# EAGLE schematic Udi's Bridge brake (EAGLE 7.2.0)
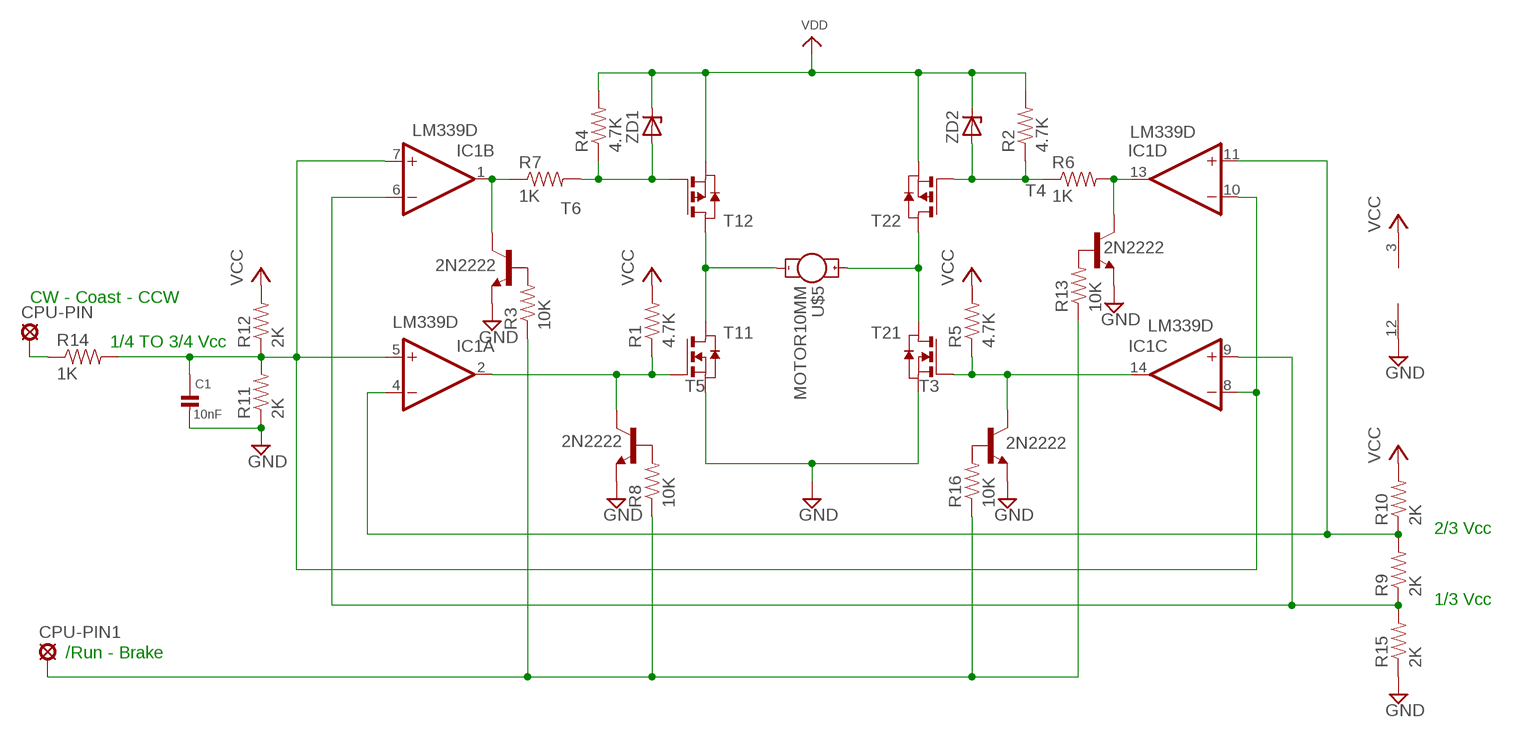
[diagram p0: schematic, sheet 1]

## Parts
C1  10nF  CAP_CERAMIC0805  [0805]
CPU-PIN  CPU I/O pin  LSP13  [LSP13]
CPU-PIN1  CPU I/O pin  LSP13  [LSP13]
IC1  LM339D  [SO14]
R1  4.7K  RESISTOR0805-RES  [0805]
R2  4.7K  RESISTOR0805-RES  [0805]
R3  10K  RESISTOR0805-RES  [0805]
R4  4.7K  RESISTOR0805-RES  [0805]
R5  4.7K  RESISTOR0805-RES  [0805]
R6  1K  RESISTOR0805-RES  [0805]
R7  1K  RESISTOR0805-RES  [0805]
R8  10K  RESISTOR0805-RES  [0805]
R9  2K  RESISTOR0805-RES  [0805]
R10  2K  RESISTOR0805-RES  [0805]
R11  2K  RESISTOR0805-RES  [0805]
R12  2K  RESISTOR0805-RES  [0805]
R13  10K  RESISTOR0805-RES  [0805]
R14  1K  RESISTOR0805-RES  [0805]
R15  2K  RESISTOR0805-RES  [0805]
R16  10K  RESISTOR0805-RES  [0805]
T1  PN_MOSFET-SO8  [SO8]
T2  PN_MOSFET-SO8  [SO8]
T3  2N2222  [TO18]
T4  2N2222  [TO18]
T5  2N2222  [TO18]
T6  2N2222  [TO18]
U$5  MOTOR10MM  [VIBE-MOTOR-10MM]
ZD1  ZENERSOD-123  [SOD-123]
ZD2  ZENERSOD-123  [SOD-123]

## Nets
GND: C1.2 IC1.12(P:GND) R11.1 R15.1 T1.1(1:S) T2.1(1:S) T3.1(E) T4.1(E) T5.1(E) T6.1(E)
N$1: T2.5(2:D) T2.6(2:D) T2.7(1:D) T2.8(1:D) U$5.+
N$2: T1.5(2:D) T1.6(2:D) T1.7(1:D) T1.8(1:D) U$5.-
N$3: IC1.1(B:OUT) R7.1 T6.3(C)
N$4: IC1.13(D:OUT) R6.2 T4.3(C)
N$5: IC1.2(A:OUT) R1.1 T1.2(1:G) T5.3(C)
N$6: IC1.14(C:OUT) R5.1 T2.2(1:G) T3.3(C)
N$7: R2.1 R6.1 T2.4(2:G) ZD2.A
N$8: R4.1 R7.2 T1.4(2:G) ZD1.A
N$9: IC1.4(A:-IN) IC1.11(D:+IN) R9.2 R10.1
N$10: IC1.6(B:-IN) IC1.9(C:+IN) R9.1 R15.2
N$11: CPU-PIN.MP R14.1
N$12: C1.1 IC1.5(A:+IN) IC1.7(B:+IN) IC1.8(C:-IN) IC1.10(D:-IN) R11.2 R12.1 R14.2
N$13: R3.2 T6.2(B)
N$14: R8.2 T5.2(B)
N$15: R13.2 T4.2(B)
N$16: R16.2 T3.2(B)
N$17: CPU-PIN1.MP R3.1 R8.1 R13.1 R16.1
VCC: IC1.3(P:V+) R1.2 R5.2 R10.2 R12.2
VDD: R2.2 R4.2 T1.3(2:S) T2.3(2:S) ZD1.C ZD2.C

## Notes on the sheet
- CW - Coast - CCW
- 1/4 TO 3/4 Vcc
- 2/3 Vcc
- 1/3 Vcc
- /Run - Brake

## Library data of the parts
C1 = microbuilder:CAP_CERAMIC: Ceramic Capacitors 0402 - 0402 Surface Mount Capacitors 16pF 50V 5% [Digikey: 445-4899-2-ND] 18pF 50V 5% [Digikey: 490-1281-2-ND] 22pF 50V 5% [Digikey: 490-1283-2-ND] 68pF 50V 5% [Digikey: 490-1289-2-ND] 0.1uF 10V 10% [Digikey: 490-1318-2-ND] 1.0uF 6.3V 10% [Digikey: 490-1320-2-ND] 0603 - 0603 Surface Mount Capacitors 16 pF 50V 5% [Digikey: 445-5051-2-ND] 22 pF 50V [Digikey: PCC220ACVTR-ND] 33 pF 50V 5% [Digikey: 490-1415-1-ND] 56pF 50V 5% [Digikey: 490-1421-1-ND] 220pF 50V 5% [Digikey: 445-1285-1-ND] 680 pF 50V 2200 pF 50V 5% C0G [Digikey: 445-1297-1-ND] 5600 pF 100V 5% X7R [Digikey: 478-3711-1-ND] 0.1 µF 25V 10% [Digikey: PCC2277TR-ND] 0.22 µF 16V 10% X7R [Digikey: 445-1318-1-ND] 1.0 µF 25V 10% [Digikey: 445-5146-2-ND] 0603 - RF Specific 3pF 250V +/-0.1pF RF [Digikey: 712-1347-1-ND] 18 pF 250V 5% [Digikey: 478-3505-1-ND or 712-1322-1-ND] 56 pF 250V 5% C0G RF [Digikey: 490-4867-1-ND] 68 pF 250V RF [Digikey: 490-4868-1-ND] 0805 - 0805 Surface Mount Capacitors 220 pF 250V 2% RF Ceramic Capacitor [Digikey: 712-1398-1-ND] 1000 pF 50V 2% NP0 Ceramic Capacitor [Digikey: 478-3760-1-ND] 0.1 µF 25V 10% Ceramic Capacitor [Digikey: PCC1828TR-ND] 1.0 µF 16V 10% Ceramic Capacitor[Digikey: 490-1691-2-ND] 10.0 µF 10V 10% Ceramic Capacitor[Digikey: 709-1228-1-ND] 10.0 uF 16V 10% Ceramic Capacitor [Digikey: 478-5165-2-ND] 47 uF 6.3V 20% Ceramic Capacitor [Digikey: 587-1779-1-ND or 399-5506-1-ND] 1206 - 1206 Surface Mount Capacitors 47uF 10V 20% Ceramic Capacitor [Digikey: 490-5528-1-ND or 399-5508-1-ND or 445-6010-1-ND] 100uF 6.3V -20%, +80% Y5V Ceramic Capacitor (Digikey: 490-4512-1-ND, Mouser: 81-GRM31CF50J107ZE1L)
CPU-PIN CPU-PIN1 = solpad:LSP13: SOLDER PAD drill 1.3 mm, distributor Buerklin, 12H562
IC1 = linear:LM339: Low Power Low Offset Voltage Quad Comparators with open collector; LM139/LM239/LM339/LM2901/LM3302
R1-R16 = ATtami:RESISTOR: Resistor Basic schematic elements and footprints for 0603, 1206, and PTH resistors.
T1 T2 = zetex:PN_MOSFET-: DUAL N AND P-CHANNEL ENHANCEMENT MODE MOSFET Source: Data sheet <http://www.farnell.com/datasheets/1693880.pdf>; OC_FARNELL: unknown; OC_NEWARK: unknown
T3-T6 = transistor:2N2222: NPN TRANSISTOR
U$5 = SparkFun-Electromechanical:MOTOR: Vibration Motor- ROB-08449 Physical dimension and wire connections for this powerful vibration motor. Motor has a self adhesive backing.
ZD1 ZD2 = ATTiny Fuse Reset with 12V Charge Pump:ZENER: Zener Diode SOD-323